# EAGLE design batteryCharger (EAGLE 9.6.2)
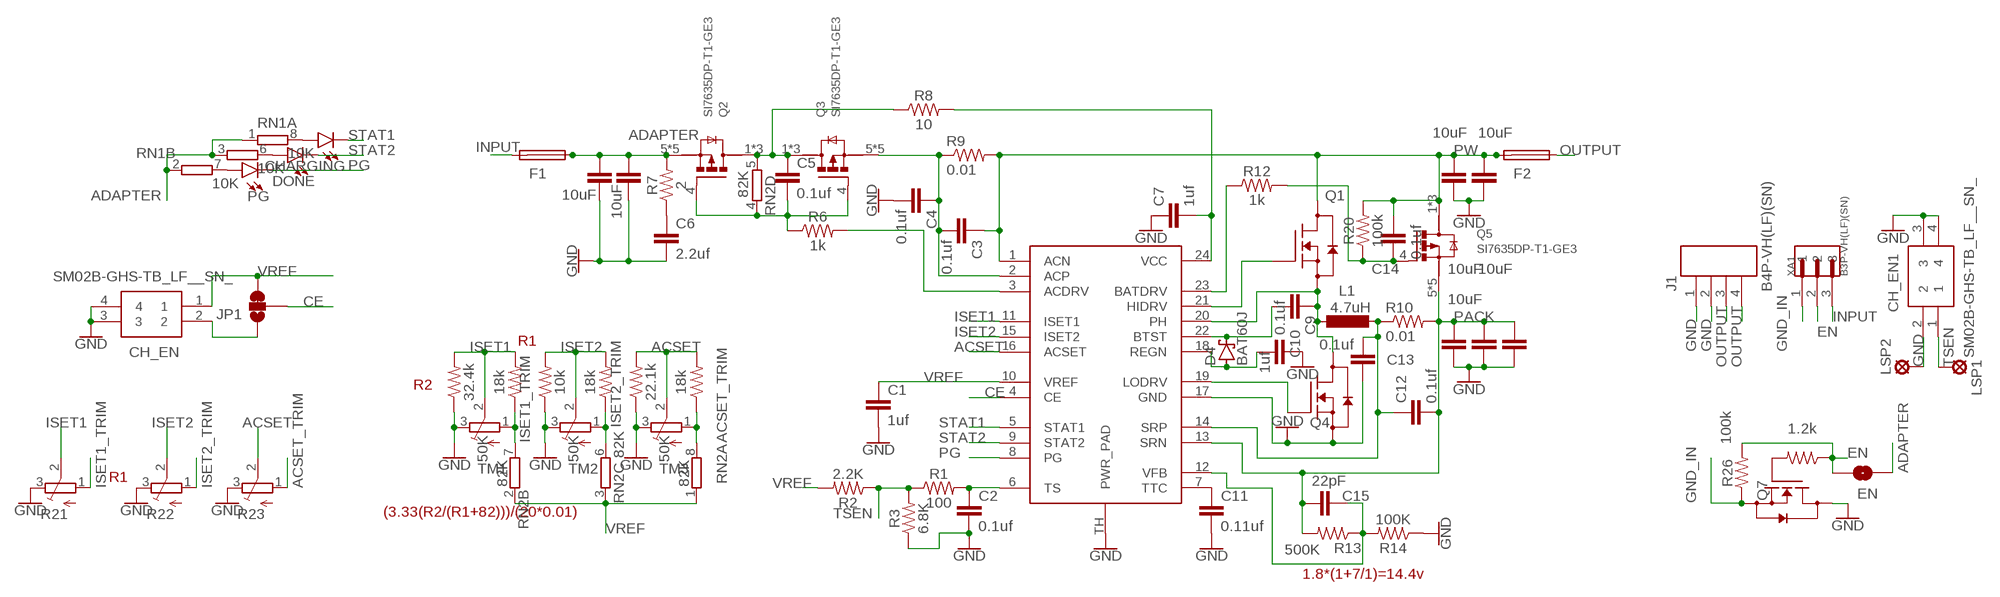
[diagram p0: schematic, sheet 1]

## Parts
C1  1uf  C-EUC0603  [C0603]
C2  0.1uf  C-EUC0603  [C0603]
C3  0.1uf  C-EUC0603  [C0603]
C4  0.1uf  C-EUC0603  [C0603]
C5  0.1uf  C-EUC0603  [C0603]
C6  2.2uf  C-EUC0603  [C0603]
C7  1uf  C-EUC0603  [C0603]
C9  0.1uf  C-EUC0603  [C0603]
C10  1uf  C-EUC0603  [C0603]
C11  0.11uf  C-EUC0603  [C0603]
C12  0.1uf  C-EUC0603  [C0603]
C13  0.1uf  C-EUC0603  [C0603]
C14  0.1uf  C-EUC0603  [C0603]
C15  22pF  C-EUC0603  [C0603]
C16  10uF  C-EUC1206  [C1206]
C17  10uF  C-EUC1206  [C1206]
C18  10uF  C-EUC1206  [C1206]
C19  10uF  C-EUC1206  [C1206]
C20  10uF  C-EUC1206  [C1206]
C21  10uF  C-EUC1206  [C1206]
C22  10uF  C-EUC1206  [C1206]
CH_EN  SM02B-GHS-TB_LF__SN_  [SM02BGHSTBLFSN]
CH_EN1  SM02B-GHS-TB_LF__SN_  [SM02BGHSTBLFSN]
CHARGING  LED1206  [LED-1206]
D4  BAT60J  [SOD323_ST]
DONE  LED1206  [LED-1206]
EN  JUMPER-SMT_2_NO_SILK  [SMT-JUMPER_2_NO_SILK]
F1  SMD-MICRO-FUSE-BLOCK  [OMNIBLOK]
F2  SMD-MICRO-FUSE-BLOCK  [OMNIBLOK]
J1  B4P-VH(LF)(SN)  [JST_B4P-VH(LF)(SN)]
JP1  JUMPER-SMT_3_1-NC_TRACE_NO-SILK  [SMT-JUMPER_3_1-NC_TRACE_NO-SILK]
L1  4.7uH  L-EUCEP125  [CEP125]
LSP1  LSP10  [LSP10]
LSP2  LSP10  [LSP10]
PG  LED1206  [LED-1206]
Q1  SIR414DP-T1-GE3  [TRANS_SQJ461EP-T1-GE3]
Q2  SI7635DP-T1-GE3  [TRANS_SI7635DP-T1-GE3]
Q3  SI7635DP-T1-GE3  [TRANS_SI7635DP-T1-GE3]
Q4  SIR414DP-T1-GE3  [TRANS_SQJ461EP-T1-GE3]
Q5  SI7635DP-T1-GE3  [TRANS_SI7635DP-T1-GE3]
Q7  SIR414DP-T1-GE3  [TRANS_SQJ461EP-T1-GE3]
R1  100  RESISTOR0603  [0603]
R2  2.2K  RESISTOR0603  [0603]
R3  6.8K  RESISTOR0603  [0603]
R4  32.4k  RESISTOR0603  [0603]
R5  18k  RESISTOR0603  [0603]
R6  1k  RESISTOR0603  [0603]
R7  2  RESISTOR0603  [0603]
R8  10  RESISTOR0603  [0603]
R9  0.01  R-US_R1206  [R1206]
R10  0.01  R-US_R1206  [R1206]
R12  1k  RESISTOR0603  [0603]
R13  500K  RESISTOR0603  [0603]
R14  100K  RESISTOR0603  [0603]
R16  10k  RESISTOR0603  [0603]
R17  18k  RESISTOR0603  [0603]
R18  22.1k  RESISTOR0603  [0603]
R19  18k  RESISTOR0603  [0603]
R20  100k  RESISTOR0603  [0603]
R21  TRIM_EU-3223W  [3223W]
R22  TRIM_EU-3223W  [3223W]
R23  TRIM_EU-3223W  [3223W]
R25  1.2k  RESISTOR0603  [0603]
R26  100k  RESISTOR0603  [0603]
RN1  10K  4R-N0603-ARC  [0603-ARC]
RN2  82K  4R-NCAY16  [CAY16]
TM1  50K  TRIMPOTTC33X  [TC33X]
TM2  50K  TRIMPOTTC33X  [TC33X]
TM3  50K  TRIMPOTTC33X  [TC33X]
U$1  BQ24630VQFN24  [HVQFN24]
XA1  B3P-VH(LF)(SN)  [JST_B3P-VH(LF)(SN)]

## Nets
ACSET: R18.2 R19.2 R23.2(S) TM3.2(S) U$1.16(ACSET)
ACSET_TRIM: R19.1 R23.1(A) RN2.8 TM3.1(A)
ADAPTER: C21.1 C22.1 EN.1 F1.P$1 Q2.5(D) Q2.6(D) Q2.7(D) Q2.8(D) Q2.9(D) R7.2 RN1.1 RN1.2 RN1.3
CE: JP1.2 U$1.4(CE)
EN: EN.2 R25.1 R26.2 XA1.2
GND: C1.2 C2.2 C4.2 C6.2 C7.1 C10.2 C11.2 C13.1 C16.2 C17.2 C18.2 C19.2 C20.2 C21.2 C22.2 CH_EN1.2 CH_EN1.3 CH_EN1.4 CH_EN.3 CH_EN.4 J1.1 J1.2 LSP2.MP Q4.1(S) Q4.2(S) Q4.3(S) Q7.5(D) Q7.6(D) Q7.7(D) Q7.8(D) Q7.9(D) R3.1 R4.1 R14.1 R16.1 R18.1 R21.3(E) R22.3(E) R23.3(E) TM1.3(E) TM2.3(E) TM3.3(E) U$1.17(GND) U$1.TH(PWR_PAD)
GND_IN: Q7.1(S) Q7.2(S) Q7.3(S) R26.1 XA1.1
INPUT: F1.P$2 XA1.3
ISET1: R4.2 R5.2 R21.2(S) TM1.2(S) U$1.11(ISET1)
ISET1_TRIM: R5.1 R21.1(A) RN2.7 TM1.1(A)
ISET2: R16.2 R17.2 R22.2(S) TM2.2(S) U$1.15(ISET2)
ISET2_TRIM: R17.1 R22.1(A) RN2.6 TM2.1(A)
N$1: C2.1 R1.2 U$1.6(TS)
N$2: CHARGING.A RN1.8
N$3: CH_EN.2 JP1.1
N$4: Q7.4(G) R25.2
N$5: DONE.A RN1.6
N$6: PG.A RN1.7
N$9: C9.2 D4.C U$1.22(BTST)
N$11: C5.1 Q2.1(S) Q2.2(S) Q2.3(S) Q3.1(S) Q3.2(S) Q3.3(S) R8.1 RN2.5
N$12: R6.2 U$1.3(ACDRV)
N$13: C3.2 C4.1 Q3.5(D) Q3.6(D) Q3.7(D) Q3.8(D) Q3.9(D) R9.1 U$1.2(ACP)
N$14: C15.1 R13.1 R14.2 U$1.12(VFB)
N$15: C7.2 R8.2 U$1.24(VCC)
N$17: Q1.4(G) U$1.21(HIDRV)
N$18: C6.1 R7.1
N$20: C12.1 C13.2 L1.2 R10.1 U$1.14(SRP)
N$22: C10.1 D4.A U$1.18(REGN)
N$23: Q4.4(G) U$1.19(LODRV)
N$24: C9.1 L1.1 Q1.1(S) Q1.2(S) Q1.3(S) Q4.5(D) Q4.6(D) Q4.7(D) Q4.8(D) Q4.9(D) U$1.20(PH)
N$25: C11.1 U$1.7(TTC)
N$26: C14.1 Q5.4(G) R12.2 R20.1
N$27: C5.2 Q2.4(G) Q3.4(G) R6.1 RN2.4
N$29: R12.1 U$1.23(BATDRV)
OUTPUT: F2.P$1 J1.3 J1.4
PACK: C12.2 C15.2 C16.1 C17.1 C18.1 Q5.5(D) Q5.6(D) Q5.7(D) Q5.8(D) Q5.9(D) R10.2 R13.2 U$1.13(SRN)
PG: PG.C U$1.8(PG)
PW: C3.1 C14.2 C19.1 C20.1 F2.P$2 Q1.5(D) Q1.6(D) Q1.7(D) Q1.8(D) Q1.9(D) Q5.1(S) Q5.2(S) Q5.3(S) R9.2 R20.2 U$1.1(ACN)
STAT1: CHARGING.C U$1.5(STAT1)
STAT2: DONE.C U$1.9(STAT2)
TSEN: CH_EN1.1 LSP1.MP R1.1 R2.1 R3.2
VREF: C1.1 CH_EN.1 JP1.3 R2.2 RN2.1 RN2.2 RN2.3 U$1.10(VREF)
Unconnected: RN1.4 RN1.5

## Notes on the sheet
- R1
- R2
- R1
- (3.33(R2/(R1+82)))/(20*0.01)
- 1.8*(1+7/1)=14.4v

## Library data of the parts
C1-C7 C9-C22 = rcl:C-EU: CAPACITOR, European symbol; SPICEPREFIX: C
CH_EN CH_EN1 = SM02B-GHS-TB_LF__SN_:SM02B-GHS-TB_LF__SN_: GH 1.25mm header side entry 2 way JST GH Series, 1.25mm Pitch 2 Way Shrouded Right Angle PCB Header, Surface Mount, Solder Termination Source: Datasheet <http://docs-emea.rs-online.com/webdocs/13ed/0900766b813ed075.pdf>; ARROW_PART_NUMBER: SM02B-GHS-TB(LF)(SN); ARROW_PRICE-STOCK: https://www.arrow.com/en/products/sm02b-ghs-tb-lf-sn/jst-manufacturing; DESCRIPTION: GH 1.25mm header side entry 2 way JST GH Series, 1.25mm Pitch 2 Way Shrouded Right Angle PCB Header, Surface Mount, Solder Termination; HEIGHT: 4.25mm; MANUFACTURER_NAME: JST (JAPAN SOLDERLESS TERMINALS); MANUFACTURER_PART_NUMBER: SM02B-GHS-TB(LF)(SN)
CHARGING DONE PG = SparkFun-LED:LED: LED (Generic) Standard schematic elements and footprints for 5mm, 3mm, 1206, and 0603 sized LEDs. Generic LEDs with no color specified.
D4 = diode:BAT60J: Schottky barrier diode Source: www.st.com, BAT60J.pdf
EN = SparkFun-Jumpers:JUMPER-SMT_2_NO: Normally open jumper This jumper has two pads in close proximity to each other. Apply solder to close the connection. Round pads are easier to solder for beginners, but are a lot larger. SparkFun Product that uses the round pads: SparkFun EL Sequencer <https://www.sparkfun.com/products/12781>
F1 F2 = f-lf-omniblok-s:SMD-MICRO-FUSE
J1 = B4P-VH_LF__SN_:B4P-VH(LF)(SN): VH Series 4 Position 3.96 mm Pitch Top Entry Locking Header; AVAILABILITY: Unavailable; DESCRIPTION: Connector Header Through Hole 4 position 0.156 (3.96mm); DIGIKEY-PURCHASE-URL: https://snapeda.com/shop?store=DigiKey&id=217136; MF: JST Sales; MP: B4P-VH(LF)(SN); PACKAGE: None; PRICE: None
JP1 = SparkFun-Jumpers:JUMPER-SMT_3_1-NC_TRACE: Normally closed trace jumper (1 of 2 connections) This jumper has a trace between two pads so it's normally closed (NC). The other connection is normally open (NO). Use a razor knife to open the connection. For best results follow the IPC guidelines for cutting traces: Cutout at least 0.063 mm (0.005 in). Remove all loose material to clean up the cut area. Seal the cut with an approved epoxy. Reapply solder to reclose the connection, or to close the NO connection.
L1 = rcl:L-EU: INDUCTOR, European symbol; SPICEPREFIX: L
LSP1 LSP2 = solpad:LSP10: SOLDER PAD drill 1.0 mm, distributor Buerklin, 12H555
Q1 Q4 Q7 = SIR414DP-T1-GE3:SIR414DP-T1-GE3: Single N-Channel 40 V 0.0028 Ohm SMT TrenchFET Power Mosfet - PowerPak-SO-8; AVAILABILITY: Unavailable; DESCRIPTION: N-Channel 40V 50A (Tc) 5.4W (Ta), 83W (Tc) Surface Mount PowerPAK® SO-8; MF: Vishay Siliconix; MP: SIR414DP-T1-GE3; PACKAGE: SO-8 Vishay Siliconix; PRICE: None
Q2 Q3 Q5 = SI7635DP-T1-GE3:SI7635DP-T1-GE3: Si7635DP Series P-Channel 20 V 0.0049 Ohms SMT Power Mosfet - PowerPAK SO-8; AVAILABILITY: Unavailable; DESCRIPTION: P-Channel 20V 40A (Tc) 5W (Ta), 54W (Tc) Surface Mount PowerPAK® SO-8; MF: Vishay; MP: SI7635DP-T1-GE3; PACKAGE: SO-8 Vishay; PRICE: None
R1-R8 R12-R14 R16-R20 R25 R26 = SparkFun-Resistors:RESISTOR: Generic Resistor Package
R9 R10 = rcl:R-US_: RESISTOR, American symbol; SPICEPREFIX: R
R21-R23 = pot:TRIM_EU-: POTENTIOMETER
RN1 RN2 = resistor-dil:4R-N: Array Chip Resistor Source: RS Component / Phycomp; OC_FARNELL: unknown; OC_NEWARK: unknown
TM1-TM3 = adafruit:TRIMPOT: SMT trimmer potentiometer part number TC33X http://www.ladyada.net/library/eagle
U$1 = bq24630:BQ24630
XA1 = B3P-VH_LF__SN_:B3P-VH(LF)(SN): VH Series 3 Position 3.96 mm Pitch Through Hole Crimp Locking Header; AVAILABILITY: Unavailable; DESCRIPTION: Connector Header Through Hole 3 position 0.156 (3.96mm); DIGIKEY-PURCHASE-URL: https://snapeda.com/shop?store=DigiKey&id=104375; MF: JST Sales; MP: B3P-VH(LF)(SN); PACKAGE: Custom Package JST; PRICE: None

## Board
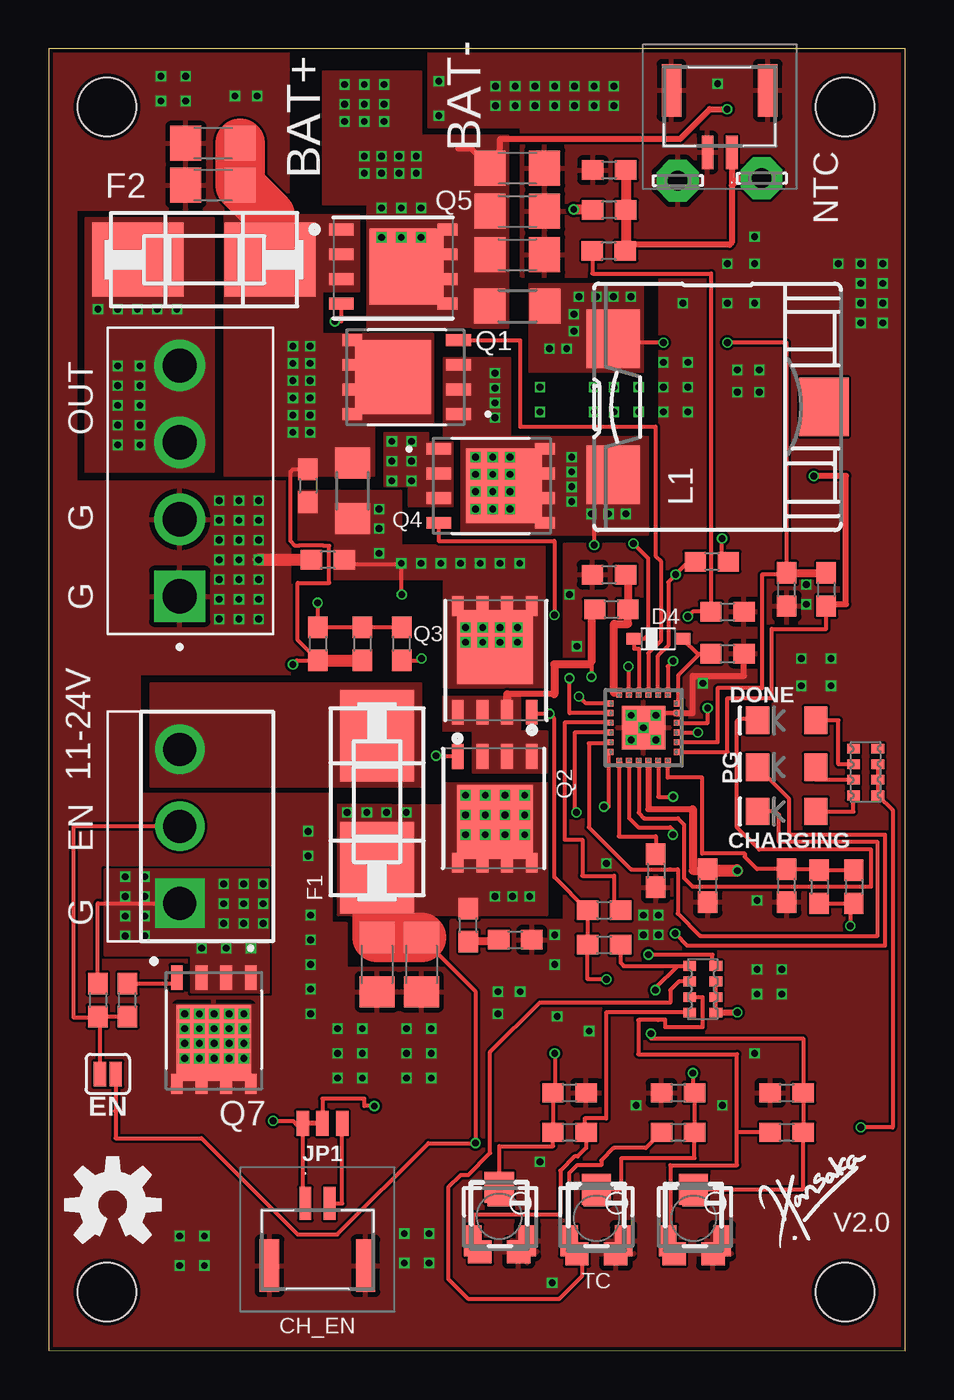
[diagram p1: board, top side]
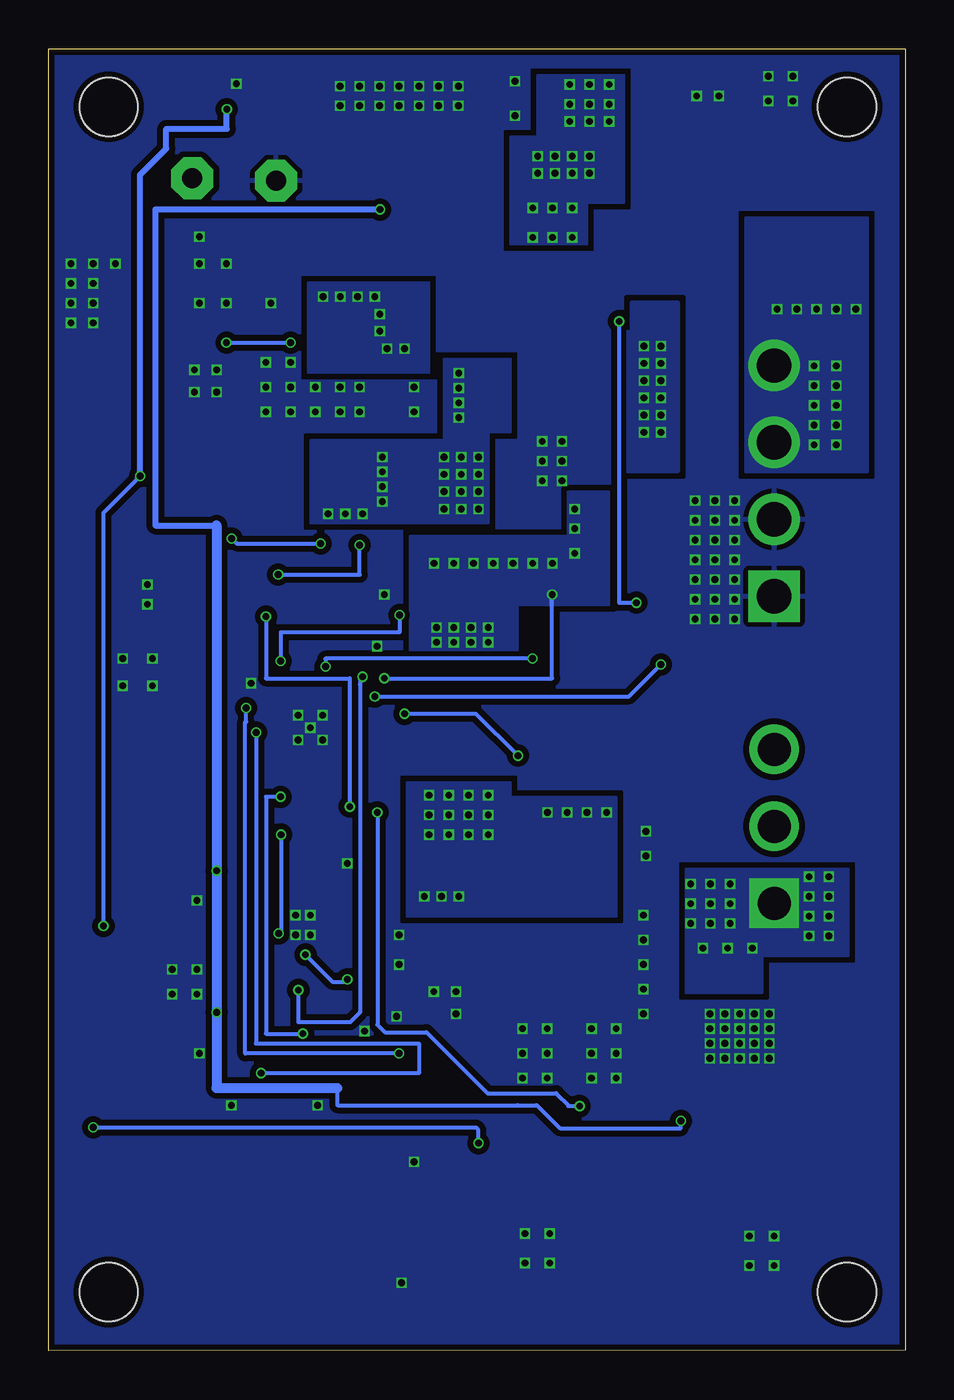
[diagram p2: board, bottom side, seen from below]

Size 44.1 x 67.03 mm. Coordinates in mm from the lower left corner, seen from the top.
Outline: 0,0.03 44.1,0 44.1,67.03 0,67.03 0,0.03
Copper layers (1*16): Top 0.035559375mm / dielectric 1.6mm / Bottom 0.035559375mm
Design rules "jlcpcb2layer": minimum track width 5mil, minimum drill 12mil, track to track 5mil, track to pad 5mil, pad to pad 5mil, via to via 5mil, smd to smd 5mil, copper to edge 8mil, drill to drill 6mil, minimum pad ring 5mil, minimum via ring 3mil, stop-mask expansion 2.5mil, vias tented up to drill 0mil, thermal gap 10mil
Holes 3 mm at 3,3.03 41,3.03 3,64.03 41,64.03

### Footprints (pad centres in the part's own frame; a part is rotated, then mirrored left to right if it is on the bottom)
C0603 = smd 1.1 x 1: 1 -0.85,0; 2 0.85,0
C1206 = smd 1.6 x 1.8: 1 -1.4,0; 2 1.4,0
SM02BGHSTBLFSN = smd 0.6 x 1.7: 1 -0.625,1.845; 2 0.625,1.845 | smd 1 x 2.7: 3 2.475,-1.355; 4 -2.475,-1.355
LED-1206 = smd 1.2 x 1.4: A -1.5,0; C 1.5,0
SOD323_ST = smd 0.8 x 0.6: A 1.25,0; C -1.25,0
SMT-JUMPER_2_NO_SILK = smd 0.635 x 1.27: 1 -0.406,0; 2 0.406,0
OMNIBLOK = smd 4.7 x 3.8: P$1 -3.4,0; P$2 3.4,0
JST_B4P-VH(LF)(SN) = drill 1.76 pad 2.64 square: 1 -5.94,0 | drill 1.76 pad 2.64: 2 -1.98,0; 3 1.98,0; 4 5.94,0
SMT-JUMPER_3_1-NC_TRACE_NO-SILK = smd 0.635 x 1.27: 1 -1.016,0; 2 0,0; 3 1.016,0
CEP125 = smd 3 x 2.75: 1 -3.5,5.375; 2 3.5,5.375 | smd 3 x 2.55: 3 0,-5.48
LSP10 = drill 1.016 pad 2.159 octagon: MP 0,0
TRANS_SQJ461EP-T1-GE3 = smd 1.27 x 0.61: 1 -2.67,1.905; 2 -2.67,0.635; 3 -2.67,-0.635; 4 -2.67,-1.905 | smd 1.02 x 0.61: 5 2.795,-1.905; 6 2.795,-0.635; 7 2.795,0.635; 8 2.795,1.905 | smd 3.91 x 3.81: 9 0.69,0
TRANS_SI7635DP-T1-GE3 = smd 1.27 x 0.61: 1 -2.67,1.905; 2 -2.67,0.635; 3 -2.67,-0.635; 4 -2.67,-1.905 | smd 1.02 x 0.61: 5 2.795,-1.905; 6 2.795,-0.635; 7 2.795,0.635; 8 2.795,1.905 | smd 3.81 x 3.91: 9 0.69,0
0603 = smd 1.1 x 1: 1 -0.85,0; 2 0.85,0
R1206 = smd 1.6 x 1.803: 1 -1.422,0; 2 1.422,0
3223W = smd 0.9 x 1.6: 1 -1.4,-1.215; 3 1.4,-1.215 | smd 1.3 x 1.3: 2 0,1.215
0603-ARC = smd 0.5 x 0.65: 1 -1.2,-0.625; 2 -0.4,-0.625; 3 0.4,-0.625; 4 1.2,-0.625; 5 1.2,0.625; 6 0.4,0.625; 7 -0.4,0.625; 8 -1.2,0.625
CAY16 = smd 0.5 x 0.65: 1 -1.2,-0.675; 2 -0.4,-0.675; 3 0.4,-0.675; 4 1.2,-0.675; 5 1.2,0.675; 6 0.4,0.675; 7 -0.4,0.675; 8 -1.2,0.675
TC33X = smd 1.2 x 1.2: 1 -1,-1.825; 3 1,-1.825 | smd 1.5 x 1.6: 2 0,1.5
HVQFN24 = smd 0.5 x 0.3: 1 -1.8,1.25; 2 -1.8,0.75; 3 -1.8,0.25; 4 -1.8,-0.25; 5 -1.8,-0.75; 6 -1.8,-1.25; 13 1.8,-1.25; 14 1.8,-0.75; 15 1.8,-0.25; 16 1.8,0.25; 17 1.8,0.75; 18 1.8,1.25 | smd 0.3 x 0.5: 7 -1.25,-1.8; 8 -0.75,-1.8; 9 -0.25,-1.8; 10 0.25,-1.8; 11 0.75,-1.8; 12 1.25,-1.8; 19 1.25,1.8; 20 0.75,1.8; 21 0.25,1.8; 22 -0.25,1.8; 23 -0.75,1.8; 24 -1.25,1.8 | smd 2.25 x 2.25: TH 0,0
JST_B3P-VH(LF)(SN) = drill 1.7 square: 1 -3.96,0 | drill 1.7: 2 0,0; 3 3.96,0

### Placement (x,y rotation side)
C1  33.93,23.95 270 top
C2  34.94,38.05 0 top
C3  13.35,44.52 270 top
C4  14.37,40.71 180 top
C5  28.59,20.9 180 top
C6  24.02,21.16 0 top
C7  28.85,39.95 0 top
C9  34.14,40.62 0 top
C10  34.94,35.89 0 top
C11  31.26,24.71 270 top
C12  40.02,39.19 270 top
C13  37.99,39.19 90 top
C14  16.15,36.4 270 top
C15  41.45,23.88 270 top
C16  24.13,60.88 0 top
C17  24.13,58.65 0 top
C18  24.13,56.41 0 top
C19  8.46,62.15 180 top
C20  8.46,59.99 180 top
C21  19.2,19.89 270 top
C22  16.91,19.89 270 top
CH_EN  13.84,5.74 0 top
CH_EN1  34.54,63.53 180 top
CHARGING  37.99,27.76 180 top
D4  31.39,36.65 0 top
DONE  37.99,32.46 180 top
EN  3.05,14.25 180 top
F1  16.91,28.27 90 top
F2  8,56.16 0 top
J1  6.75,44.78 90 top
JP1  14.1,11.71 180 top
L1  34.44,48.59 90 top
LSP1  36.7,60.35 0 top
LSP2  32.38,60.23 0 top
PG  37.99,30.05 180 top
Q1  18.43,50.11 180 top
Q2  22.97,27.92 270 top
Q3  22.97,35.54 90 top
Q4  22.75,44.52 0 top
Q5  17.73,55.8 0 top
Q7  8.51,16.54 270 top
R1  28.84,56.62 180 top
R2  28.86,58.72 180 top
R3  28.86,60.78 0 top
R4  37.99,13.28 0 top
R5  37.99,11.25 0 top
R6  28.59,22.68 0 top
R7  21.61,21.92 90 top
R8  28.98,38.17 0 top
R9  15.64,44.27 90 top
R10  24.13,53.77 180 top
R12  18.18,36.4 90 top
R13  39.67,23.88 270 top
R14  37.99,23.95 90 top
R16  32.4,13.28 0 top
R17  32.4,11.25 0 top
R18  26.82,13.28 180 top
R19  26.82,11.25 180 top
R20  13.86,36.4 270 top
R21  33.27,6.88 0 top
R22  28.19,6.88 0 top
R23  23.24,6.88 0 top
R25  4.06,18.06 90 top
R26  2.54,18.06 270 top
RN1  42.06,29.79 90 top
RN2  33.67,18.62 90 top
TM1  33.2,6.83 0 top
TM2  28.2,6.83 0 top
TM3  23.2,6.93 0 top
U$1  30.63,32.08 0 top
U$2  [SIGNATURE]  36.45,4.09 0 top
U$3  [OSHW-LOGO-M]  3.3,7.52 0 top
XA1  6.75,27 90 top

### Tracks (layer width: path | path; a pad name or v marks a point on that pad's centre or on a via)
ACSET  (via drill 0.35)
  Top 0.203: U$1.16 33.93,32.33 v33.93,33.09 | v26.05,15.31 26.05,13.28 R18.2 R19.2 25.97,10.53 23.2,10.53 TM3.2 23.2,8.1 R23.2
  Bottom 0.203: v33.93,33.09 33.93,32.38 33.98,32.38 33.98,15.31 v26.05,15.31
ACSET_TRIM
  Top 0.152: 27.59,11.17 R19.1
  Top 0.203: RN2.8 28.7,17.42 28.7,11.96 27.59,11.96 27.59,11.17 | R19.1 27.67,10.44 27.23,10.01 27.07,10.01 26.34,9.28 26.34,7.06 26.29,7.01 21.84,7.01 R23.1 21.84,5.1 TM3.1
ADAPTER  (via drill 0.35)
  Top 0.203: RN1.3 RN1.2 RN1.1 43.44,27.83 43.44,11.5 v41.8,11.5 | C21.1 21.97,18.51 v21.97,10.69 19.56,10.69 14.86,6 12.83,6 7.87,10.95 3.45,10.95 3.45,12.37 | EN.1 3.45,12.37 | 3.45,12.37 3.43,12.35
  Top 2.54: F1.P$1 C22.1 C21.1
  Bottom 0.203: v41.8,11.5 22.1,11.5 21.97,11.38 v21.97,10.69
  other vias: 15.37,27.71 16.38,27.71 17.4,27.71 18.41,27.71 21.46,28.6 22.48,28.6 23.5,28.6 24.51,28.6 21.46,27.59 22.48,27.59 23.5,27.59 24.51,27.59 21.46,26.57 22.48,26.57 23.5,26.57 24.51,26.57 22.99,23.39 23.88,23.39 24.77,23.39
  pour Top (no thermals): 25.67,22.43 25.67,29.24 20.45,29.24 20.45,28.09 14.88,28.14 14.88,22.43
  pour Bottom (isolate 0.254): 20.32,29.24 25.65,29.24 25.65,22.38 14.86,22.38 14.86,28.48 20.32,28.48
CE  (via drill 0.35)
  Top 0.203: U$1.4 27.07,31.83 27.07,27.82 v27.18,27.71 | v16.76,12.6 16.26,12.6 16.26,12.98 14.1,12.98 JP1.2
  Bottom 0.203: v27.18,27.71 27.18,16.79 26.79,16.41 24.65,16.41 21.51,13.26 17.98,13.26 17.34,12.63 17.34,12.6 v16.76,12.6
EN
  Top 0.203: XA1.2 1.27,27 1.27,17.17 2.54,17.17 R26.2 | 4.06,17.17 R25.1 R26.2 | R26.2 2.64,17.11 EN.2
GND  (via drill 0.35)
  Top 0.152: TM3.3 24.2,5.23 | TM1.3 34.2,5.2
  Top 0.203: U$1.17 30.63,32.83 U$1.TH | TM2.3 29.59,5 R22.3
  Top 0.305: U$1.17 33.17,32.83 33.17,34.74 35.79,34.74 C10.2
  Top 0.61: C4.2 v10.81,40.71
  other vias: 17.67,46.81 18.69,46.81 17.67,45.79 18.69,45.79 17.67,44.78 18.69,44.78 8.78,43.76 9.8,43.76 10.81,43.76 8.78,42.75 9.8,42.75 10.81,42.75 8.78,41.73 9.8,41.73 10.81,41.73 8.78,40.71 9.8,40.71 13.48,22.43 13.48,19.89 13.48,18.62 13.48,21.16 10.05,15.06 9.29,15.06 10.05,15.82 13.48,17.35 23.13,18.49 9.29,15.82 8.53,15.06 7.77,15.06 25.29,49.6 25.29,48.33 28.09,48.33 28.09,49.6 29.1,49.6 30.37,49.6 29.1,48.33 30.37,48.33 31.64,49.6 31.64,48.33 31.64,50.87 32.91,49.6 32.91,50.87 32.91,48.33 25.04,65.1 26.05,65.1 25.04,64.08 26.05,64.08 27.07,65.1 20.09,63.57 20.09,65.35 27.07,64.08 28.09,65.1 28.09,64.08 29.1,65.1 29.1,64.08 34.94,55.95 36.34,55.95 34.94,53.92 36.34,53.92 7,15.06 7.77,15.82 8.53,15.82 7,15.82 6.75,5.92 8.02,5.92 6.75,4.39 8.02,4.39 16.15,16.58 16.15,15.31 16.15,14.04 14.88,16.58 14.88,15.31 14.88,14.04 18.43,16.58 19.7,16.58 18.43,15.31 19.7,15.31 19.7,14.04 18.43,14.04 26.05,21.41 26.05,19.89 13.35,26.74 13.35,25.47 38.75,35.63 40.28,34.24 40.28,35.63 38.75,34.24 36.47,23.19 36.47,19.63 37.74,19.63 36.47,18.36 37.74,18.36 9.59,64.59 10.74,64.59 5.78,64.34 7.05,64.34 5.78,65.61 7.05,65.61 34.69,12.65 36.34,15.31 33.67,34.36 26.82,38.94 27.2,36.27 39.01,38.43 39.01,39.44 31.39,22.43 31.39,21.41 24.28,18.49 30.25,12.65 29.99,32.71 31.26,32.71 29.99,31.44 31.26,31.44 30.63,32.08 25.93,3.5 27.83,16.46 23.01,65.1 24.02,65.1 23.01,64.08 24.02,64.08 36.34,57.35 34.44,65.22 40.66,55.95 41.8,55.95 42.95,55.95 42.95,54.94 42.95,53.92 41.8,54.94 41.8,53.92 41.8,52.91 42.95,52.91 30.63,22.43 30.63,21.41 7,17.35 7.77,17.35 8.53,17.35 9.29,17.35 10.05,17.35 7,16.58 7.77,16.58 8.53,16.58 9.29,16.58 10.05,16.58 18.31,6.04 19.58,6.04 18.31,4.52 19.58,4.52 8.78,39.7 8.78,38.68 8.78,37.66 9.8,39.7 10.81,39.7 9.8,38.68 10.81,38.68 9.8,37.66 10.81,37.66 35.45,49.35 36.59,49.35 35.45,50.49 36.59,50.49 25.29,9.72 26.18,17.22 32.66,53.92 28.72,25.09 23.13,17.35
  pour Top (isolate 0.127, rank 2): -0.05,0.03 44.17,0.03 44.17,67.01 19.58,67.01 19.58,63.02 24.33,63.02 24.33,55.35 31.47,55.35 31.47,41.48 26.54,41.48 26.54,22.12 20.73,22.12 20.73,19.66 15.32,19.66 15.32,21.97 14.55,21.97 14.55,28.6 4.67,28.6 4.67,34.9 19.81,34.9 19.81,39.37 12.4,39.37 12.4,44.68 1.4,44.68 1.4,58.78 12.32,58.78 12.32,67.01 -0.05,67.01
  pour Bottom (isolate 0.305, rank 2): 0,0.08 44.17,0.08 44.17,67.01 0,67.01
  pour Top (no thermals): 20.83,43.46 20.83,46.76 19.56,46.76 19.56,47.27 17.27,47.27 17.27,44.48 18.54,44.48 18.54,43.46
  pour Top (rank 2, no thermals): 5.97,17.81 11.3,17.81 11.3,12.85 5.97,12.85
GND_IN  (via drill 0.35)
  Top 0.203: R26.1 2.54,23.04 XA1.1
  other vias: 9.02,24.03 10.03,24.03 9.02,23.01 10.03,23.01 11.05,24.03 11.05,23.01 9.02,22 10.03,22 11.05,22 7.87,20.73 9.14,20.73 10.41,20.73 3.94,24.41 3.94,23.39 3.94,22.38 3.94,21.36 4.95,24.41 4.95,23.39 4.95,22.38 4.95,21.36
  pour Top (isolate 0.305, no thermals): 2.92,24.79 11.3,24.79 11.3,18.44 7.37,18.44 7.37,20.35 2.92,20.35
  pour Bottom (isolate 0.305, no thermals): 2.92,24.79 11.3,24.79 11.3,18.44 7.37,18.44 7.37,20.35 2.92,20.35
INPUT
  pour Top (no thermals): 5.23,29.03 19.2,29.03 19.2,34.36 5.23,34.36
ISET1  (via drill 0.35)
  Top 0.203: U$1.11 31.39,28.52 v32.15,28.52 | v31.01,16.33 31.01,16.07 38.84,16.07 R4.2 R5.2 38.84,8.33 TM1.2 33.27,8.33 R21.2
  Bottom 0.203: v32.15,28.52 32.91,28.52 32.91,16.33 v31.01,16.33
ISET1_TRIM
  Top 0.152: 37.1,11.2 R5.1
  Top 0.203: RN2.7 33.66,18.21 33.66,16.66 31.75,16.66 31.75,17.05 31.39,17.05 31.39,17.03 30.35,17.03 30.35,15.27 35.43,15.27 35.43,11.25 | R5.1 35.43,11.25 | 35.43,11.25 35.43,9.55 32,9.55 32,5 | TM1.1 32,5 | 32,5 31.87,5 R21.1
ISET2  (via drill 0.35)
  Top 0.203: U$1.15 v33.42,31.82 | v33.17,14.3 33.17,13.28 R16.2 R17.2 33.25,9.93 29.5,9.93 29.5,8.33 TM2.2 R22.2
  Bottom 0.203: v33.42,31.82 33.42,15.82 25.04,15.82 25.04,14.3 v33.17,14.3
ISET2_TRIM
  Top 0.203: RN2.6 32.45,19.02 32,18.57 32,17.93 25.29,17.93 22.73,15.38 22.73,10.19 21.59,9.04 21.21,9.04 20.57,8.41 20.57,3.71 21.59,2.69 26.29,2.69 27.47,3.88 27.47,4.73 TM2.1 27.2,5.26 R22.1 26.79,9.14 27.2,9.55 28.45,9.55 28.45,9.81 29.08,10.44 30.75,10.44 R17.1
N$1  (via drill 0.35)
  Top 0.203: R1.2 27.99,55.45 34.09,55.45 C2.1 33.17,38.05 v32.91,37.79 | U$1.6 28.83,28.01 v28.59,28.01
  Bottom 0.203: v28.59,28.01 28.59,34.62 32.91,34.62 v32.91,37.79
N$2
  Top 0.203: CHARGING.A 41.43,27.76 RN1.8
N$3
  Top 0.203: CH_EN.2 15.11,7.59 JP1.1
N$4
  Top 0.203: R25.2 6.6,18.91 Q7.4
N$5
  Top 0.203: RN1.6 40.66,30.19 40.66,32.46 DONE.A
N$6
  Top 0.203: RN1.7 39.49,29.39 PG.A
N$9  (via drill 0.35)
  Top 0.203: U$1.22 30.38,36.14 30.14,36.14 D4.C 30.65,36.65 30.86,36.86 30.86,40.79 v30.1,41.56 | C9.2 34.67,40.94 v34.67,41.81
  Bottom 0.203: v34.67,41.81 34.42,41.56 v30.1,41.56
N$11  (via drill 0.35)
  Top 0.203: R8.1 27.94,37.99 | 27.81,35.33 27.94,35.46 v27.94,34.7 | 23.62,33.81 23.6,33.79 | C5.1 29.44,19.99 29.61,19.82 32.38,19.82 | 32.38,19.82 RN2.5 | v31.24,18.57 31.24,18.67 32.38,19.82
  Top 0.305: 26.04,33.81 23.62,33.81
  Top 0.406: 27.94,37.99 27.94,35.46 | 27.81,35.33 26.04,35.33 26.04,33.81 | 23.6,33.79 Q3.3
  Bottom 0.203: v27.94,34.7 28.07,34.57 28.07,34.31 28.07,17.42 28.57,16.92 31.24,16.92 v31.24,18.57
  pour Top (no thermals): 20.32,33.68 24.26,33.68 24.26,31.9 25.65,31.9 25.65,29.87 25.65,29.75 21.84,29.75 21.84,31.9 20.32,31.9
N$12
  Top 0.203: U$1.3 26.56,32.33 26.56,26.31 27.48,26.31 27.48,24.46 29.1,24.46 29.1,22.68 R6.2
N$13  (via drill 0.35)
  Top 0.203: U$1.2 26.82,32.83 v26.82,34.62 | v18.18,38.94 18.18,40.46 15.22,40.46 C4.1
  Bottom 0.203: v26.82,34.62 18.18,34.62 v18.18,38.94
  other vias: 17.02,41.05 18.16,40.54 19.18,40.54 21.46,36.48 21.46,37.24 22.35,37.24 24.13,36.48 20.19,40.54 21.21,40.54 22.23,40.54 23.24,40.54 24.26,40.54 17.02,43.33 17.02,42.32 22.35,36.48 23.24,37.24 23.24,36.48 24.13,37.24
  pour Top (no thermals): 20.34,34.11 25.55,34.11 25.55,41.48 18.18,41.48 18.18,44.27 12.85,44.27 12.85,41.73 14.37,41.73 14.37,39.7 20.34,39.7
  pour Bottom (isolate 0.254): 25.53,35.97 19.94,35.97 19.94,38.38 15.24,38.38 15.24,44.22 17.4,44.22 17.4,41.94 25.53,41.94
N$14
  Top 0.203: U$1.12 31.88,29.51 33.65,29.51 33.65,25.6 35.83,25.6 35.83,25.43 36.47,24.8 R14.2 39.6,24.8 R13.1 C15.1
N$15
  Top 0.203: C7.2 29.82,39.82 | U$1.24 29.1,33.88
  Top 0.406: 29.82,39.82 R8.2 29.82,37.41 29.1,37.41 29.1,33.88
N$17
  Top 0.203: Q1.4 24.28,52.02 24.28,47.57 31.26,47.57 31.24,47.56 31.24,40.92 31.51,40.65 31.51,36.54 30.88,35.91 U$1.21
N$18
  Top 0.406: C6.1 23.08,21.07 R7.1
N$20  (via drill 0.35)
  Top 0.203: v34.94,51.89 37.99,51.89 C13.2 37.99,39.95 36.72,39.95 36.72,34.11 34.44,34.11 34.44,31.32 32.43,31.32 U$1.14 | L1.2 29.86,52.09 29.86,52.65 27.83,52.65 27.83,51.89 v31.64,51.89
  Top 0.406: C13.2 C12.1
  Bottom 0.203: v34.94,51.89 v31.64,51.89
  other vias: 29.97,54.26 29.08,54.26 28.19,54.26 27.3,54.26 27.05,53.37 27.05,52.48 26.67,51.59 25.78,51.59
  pour Top (no thermals): 24.74,54.94 24.74,50.37 30.63,50.37 30.63,54.94
  pour Bottom (isolate 0.305): 24.51,55.02 24.51,50.32 30.73,50.32 30.73,55.02
N$22
  Top 0.203: 32.66,36.65 D4.A 33.4,35.89 33.53,35.89 | 33.53,35.89 C10.1 | U$1.18 32.43,34.79 33.53,35.89
N$23  (via drill 0.35)
  Top 0.203: 20.08,42.49 Q4.4 20.08,41.68 26.04,41.68 v26.04,37.87 | v32.15,35.51 31.88,35.23 U$1.19
  Bottom 0.203: v26.04,37.87 26.04,36.98 32.15,36.98 v32.15,35.51
N$24  (via drill 0.35)
  Top 0.203: v28.09,41.48 28.09,45.09 L1.1 | U$1.20 31.38,35.78 31.9,36.3 31.9,39.57 v32.28,39.95 32.95,40.62 C9.1
  Bottom 0.203: v32.28,39.95 28.09,39.95 v28.09,41.48
  other vias: 21.97,46 22.86,46 23.75,46 21.97,45.11 21.97,44.22 21.97,43.33 22.86,43.33 23.75,43.33 23.75,44.22 22.86,44.22 23.75,45.11 22.86,45.11 22.99,50.32 22.99,49.56 22.99,48.8 22.99,48.03 26.92,46 26.92,45.24 26.92,44.48 26.92,43.72 27.94,43.08 28.83,43.08 29.72,43.08
  pour Top (no thermals): 20.34,51.13 23.77,51.13 23.77,47.06 30.88,47.06 30.88,41.98 21.23,41.98 21.23,47.06 20.34,47.06
  pour Bottom (isolate 0.254): 21.46,47.27 21.46,42.57 30.61,42.57 30.61,46.89 23.75,46.89 23.75,51.08 20.32,51.08 20.32,47.27
N$25
  Top 0.203: 29.44,30.28 U$1.7 29.36,30.28 29.36,26.49 31.26,26.49 C11.1
N$26  (via drill 0.35)
  Top 0.203: Q5.4 15.06,52.99 v14.73,52.99 | v13.84,38.51 13.84,37.25 R20.1 C14.1 R12.2
  Bottom 0.203: v14.73,52.99 14.73,38.51 v13.84,38.51
N$27  (via drill 0.35)
  Top 0.152: 24.95,32.79 Q3.4
  Top 0.203: RN2.4 34.18,19.82 34.18,20.39 v30.88,20.39 | v28.72,19.12 27.74,19.12 C5.2 R6.1 26.04,24.39 26.04,32.54 v25.78,32.79 24.95,32.79 | Q2.4 19.98,30.59 v19.94,30.63
  Bottom 0.203: v30.88,20.39 29.48,19 28.85,19 v28.72,19.12 | v19.94,30.63 22.1,32.79 v25.78,32.79
N$29  (via drill 0.35)
  Top 0.203: R12.1 19.2,35.55 v19.2,35.63 | v29.85,35.23 29.85,33.88 U$1.23
  Bottom 0.203: v19.2,35.63 29.85,35.63 v29.85,35.23
OUTPUT  (via drill 0.35)
  other vias: 4.7,50.7 3.56,50.7 3.56,49.68 4.7,49.68 3.56,48.67 4.7,48.67 3.56,47.65 4.7,47.65 3.56,46.64 4.7,46.64 2.54,53.62 3.56,53.62 4.57,53.62 5.59,53.62 6.6,53.62
  pour Top (no thermals): 1.91,58.32 8.51,58.32 8.51,45.24 1.91,45.24
  pour Bottom (isolate 0.305, no thermals): 1.91,58.32 8.26,58.32 8.26,45.24 1.91,45.24
PACK  (via drill 0.35)
  Top 0.203: U$1.13 34.94,30.83 34.94,33.6 37.23,33.6 37.23,37.16 40.02,37.16 C12.2 | R13.2 C15.2 41.27,22.86 v41.27,21.87
  Top 0.305: C12.2 40.02,38.43 41.04,38.43 41.04,45.03 v39.39,45.03 | 21.08,61.88 21.73,61.88 C16.1 23.24,60.88 23.24,62.38 32.51,62.38 34.04,63.91 v34.92,63.91
  Bottom 0.203: v41.27,21.87 41.27,43.15 v39.39,45.03
  Bottom 0.305: v39.39,45.03 39.39,60.52 38.04,61.88 38.04,62.89 34.92,62.89 v34.92,63.91
  other vias: 17.14,58.83 18.16,58.83 19.18,58.83 17.14,57.3 18.16,57.3 19.18,57.3 15.24,65.18 16.26,65.18 17.27,65.18 15.24,64.16 16.26,64.16 17.27,64.16 15.24,63.27 17.27,63.27 16.26,63.27 16.26,61.5 17.14,61.5 18.03,61.5 18.92,61.5 16.26,60.61 17.14,60.61 18.03,60.61 18.92,60.61
  pour Top (isolate 0.305, no thermals): 14.12,65.86 14.12,59 16.4,59 16.4,52.65 23.68,52.65 23.68,62.56 19.2,62.56 19.2,65.86
  pour Bottom (isolate 0.305): 14.48,65.69 14.48,59.08 16.38,59.08 16.38,56.92 16.51,56.92 20.32,56.92 20.32,62.51 18.92,62.51 18.92,65.69
PG  (via drill 0.35)
  Top 0.203: U$1.8 29.88,27.43 30.35,26.95 32,26.95 32.13,26.82 v32.13,26.57 | v32.26,21.49 32.89,20.86 43.05,20.86 43.05,26.57 38.1,26.57 38.1,28.44 PG.C
  Bottom 0.203: v32.13,26.57 32.13,21.62 v32.26,21.49
PW  (via drill 0.35)
  Top 0.203: U$1.1 27.66,33.33 v27.31,33.68 | v12.57,35.33 12.79,35.55 R20.2 12.83,36.58 12.83,39.52 14.44,39.52 14.44,41.43 14.18,41.43 14.16,41.44 12.88,41.44 12.86,41.43 12.7,41.43 12.45,41.68 12.45,45.24 12.58,45.37 C3.1
  Top 0.61: R20.2 C14.2
  Top 2.54: C19.1 C20.1 11.4,58.45 F2.P$2
  Bottom 0.203: v27.31,33.68 14.22,33.68 v12.57,35.33
  other vias: 12.57,51.72 13.46,51.72 12.57,50.83 13.46,50.83 12.57,49.94 13.46,49.94 12.57,49.05 13.46,49.05 12.57,48.16 13.46,48.16 12.57,47.27 13.46,47.27
  pour Top (no thermals): 16,58.48 16,54.51 14.1,54.51 14.1,52.35 19.81,52.35 19.81,47.78 16.76,47.78 16.79,47.75 16.79,45.03 9.03,45.03 9.03,58.48
  pour Bottom (isolate 0.254): 11.68,54 11.68,45.24 14.35,45.24 14.35,52.48 14.1,52.48 14.1,54
STAT1
  Top 0.203: U$1.5 28.77,31.27 27.81,31.27 27.81,26.95 29.98,24.78 31.98,24.78 31.99,24.79 32.38,24.79 32.38,22.51 33.53,21.36 42.67,21.36 42.67,26.19 37.59,26.19 37.59,27.59 37.42,27.76 CHARGING.C
STAT2
  Top 0.203: U$1.9 30.38,27.69 30.66,27.41 32.4,27.41 32.72,27.09 32.72,24.34 33.15,23.9 42.34,23.9 42.34,25.81 36.58,25.81 35.43,26.95 35.43,32.41 35.56,32.54 36.41,32.54 DONE.C
TSEN
  Top 0.305: 29.71,57.05 29.71,56.92 35.05,56.92 35.17,57.04 35.17,59.97 | CH_EN1.1 35.17,59.97 | 35.17,59.97 35.55,60.35 LSP1.MP
  Top 0.508: R1.1 29.71,56.64 29.71,57.05 R2.1 R3.2 29.83,60.78
VREF  (via drill 0.35)
  Top 0.203: RN2.1 RN2.2 RN2.3 | JP1.3 13.08,11.33 | 13.08,11.33 13.08,7.59 CH_EN.1 | v11.56,11.84 12.6,11.84 12.72,11.71 12.72,11.69 13.08,11.33
  Top 0.305: RN2.1 v35.45,17.43 | U$1.10 30.88,27.89 33.17,27.89
  Top 0.406: 33.17,27.89 33.17,24.71 33.93,24.71 C1.1
  Top 0.508: 35.45,24.8 v35.45,24.71 | R2.2 27.99,58.75 v27.03,58.75
  Top 0.61: v35.45,24.71 33.93,24.71
  Bottom 0.203: 29.23,13.53 29.23,12.65 19.96,12.65 18.97,12.65 17.78,11.46 11.56,11.46 v11.56,11.84
  Bottom 0.305: v27.03,58.75 38.61,58.75 38.61,42.49 35.45,42.49
  Bottom 0.508: 29.23,13.53 35.45,13.53 v35.45,17.43 v35.45,24.71 35.45,42.49

### Text on the board
tNames: BAT- | NTC | BAT+ | OUT | G | G | 11-24V | EN | G | V2.0 | TC
tValues: +
tStop: INPUT A | OUTPUT A